# Altium project GBA.PrjPcb (part 2 of 4)

## Sheet [06] - Audio.SchDoc
size A3; DocumentNumber: 8; SheetNumber: 7; SheetTotal: 9
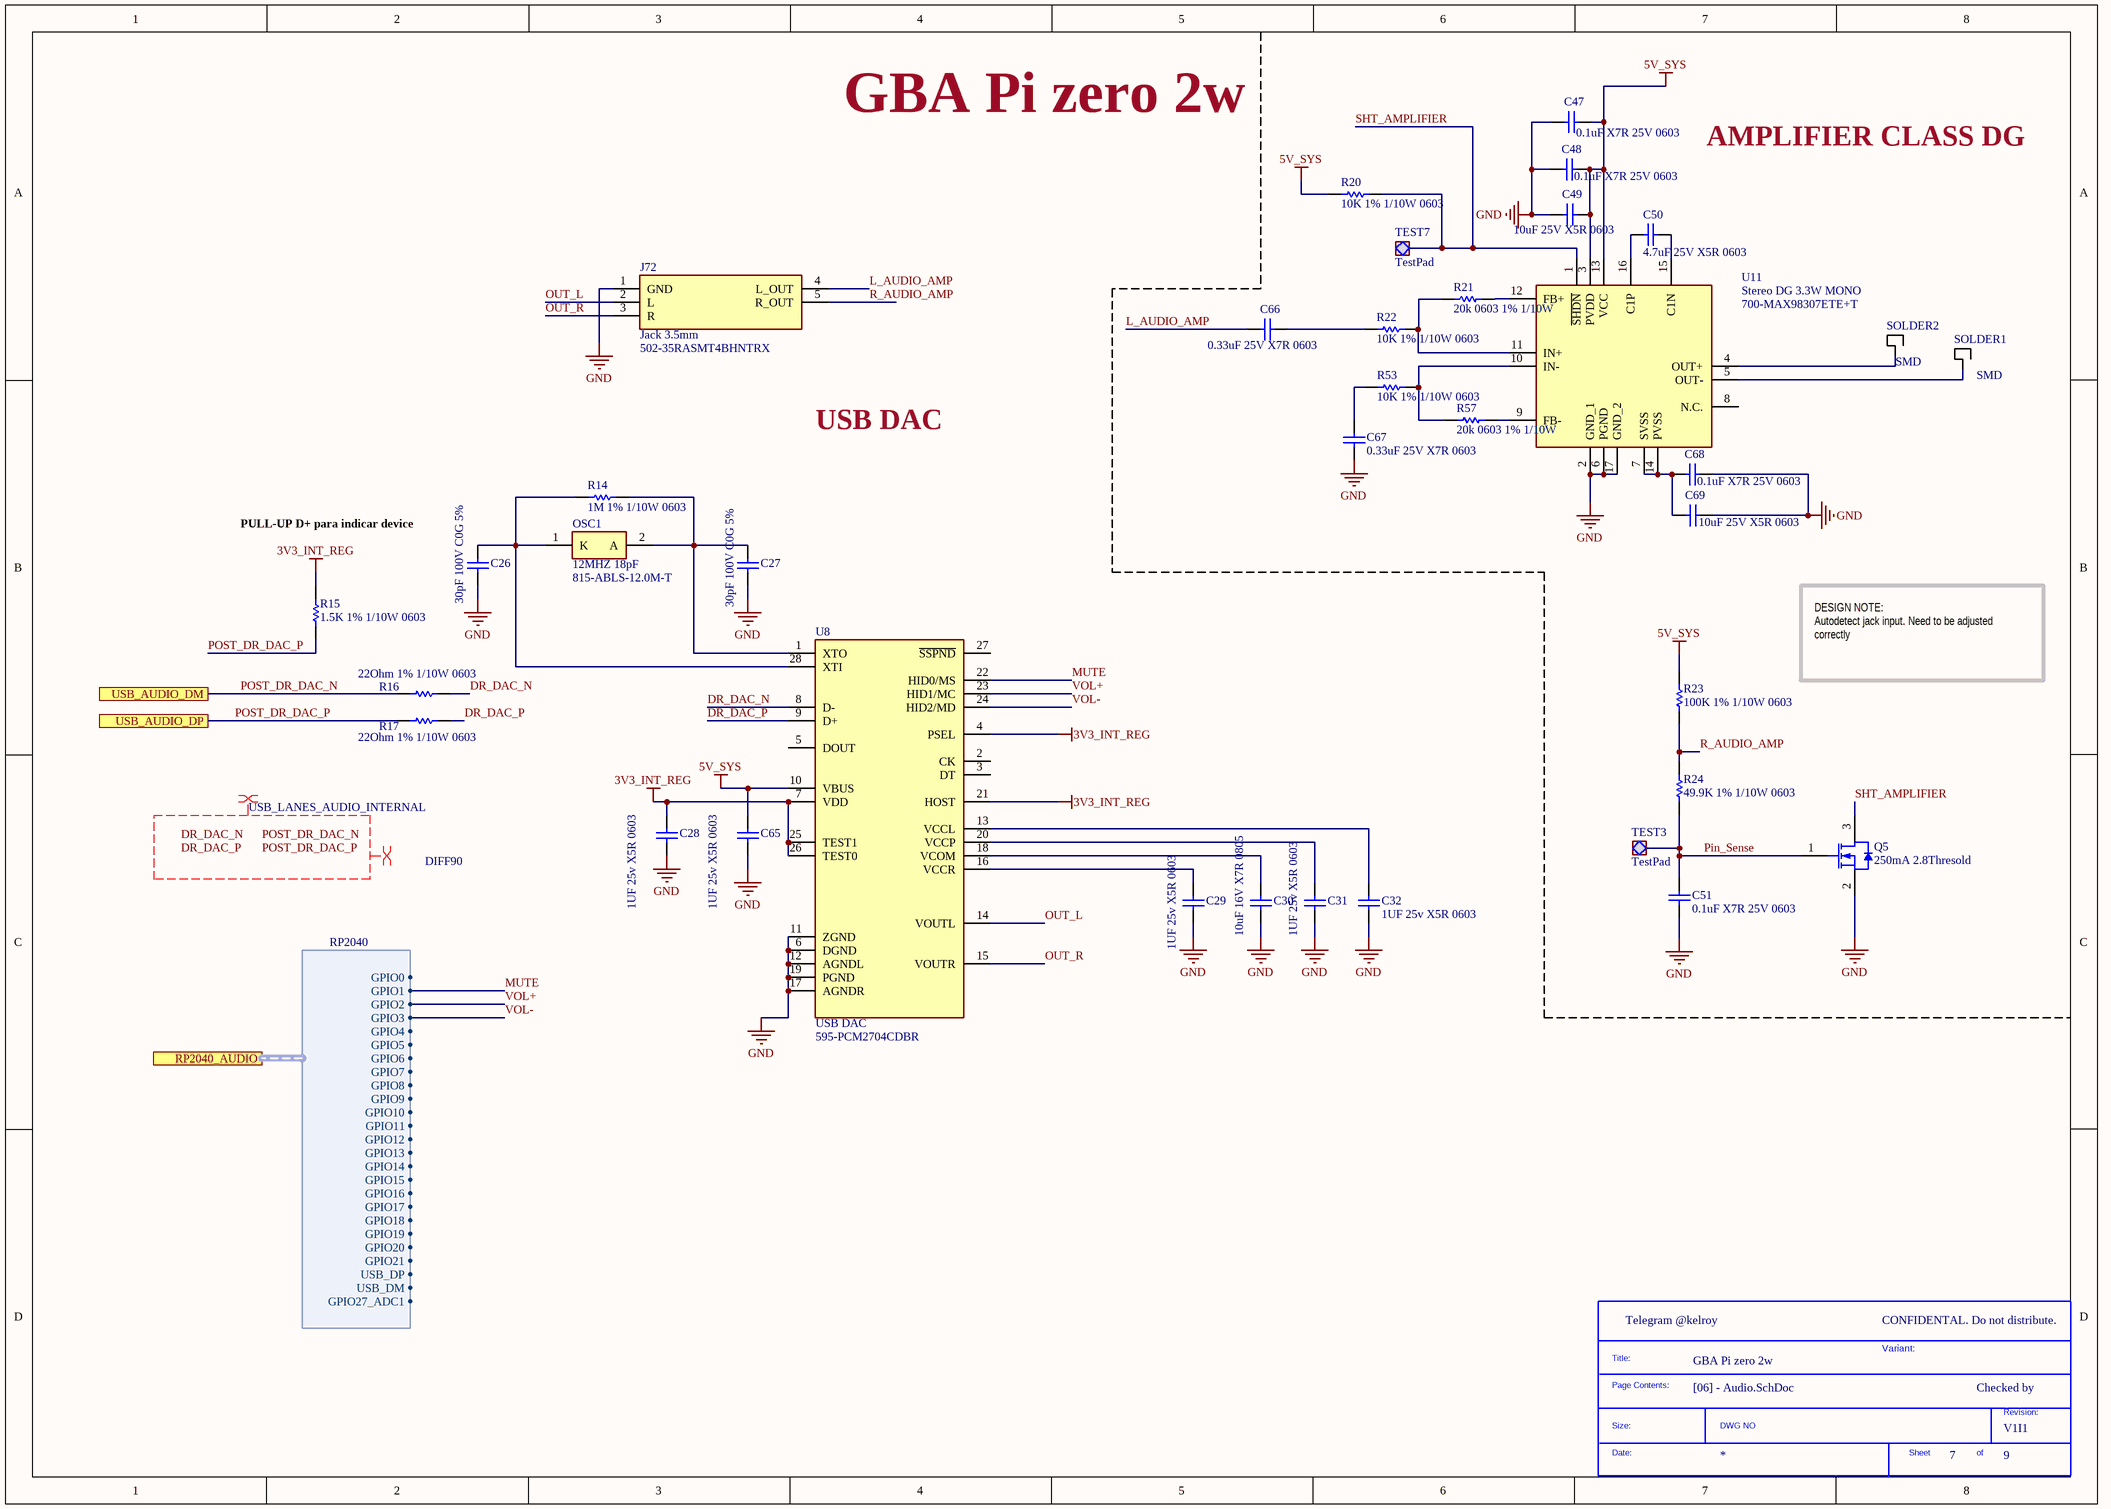
[diagram p6: [06] - Audio.SchDoc]

### Parts
(Parts that share a designator on the sheet are numbered #1, #2 ... from top to bottom, then left to right.)
*#7  SDTitleBlock  (value not drawn)  (graphical)
C26  30pF 100V C0G 5%  [C 0603/1608]
C27  30pF 100V C0G 5%  [C 0603/1608]
C28  1UF 25v X5R 0603  [C 0603/1608]
C29  1UF 25v X5R 0603  [C 0603/1608]
C30  10uF 16V X7R 0805  [C 0805/2012]
C31  1UF 25v X5R 0603  [C 0603/1608]
C32  1UF 25v X5R 0603  [C 0603/1608]
C47  0.1uF X7R 25V 0603  [C 0603/1608]
C48  0.1uF X7R 25V 0603  [C 0603/1608]
C49  10uF 25V X5R 0603  [C 0603/1608]
C50  4.7uF 25V X5R 0603  [C 0603/1608]
C51  0.1uF X7R 25V 0603  [C 0603/1608]
C65  1UF 25v X5R 0603  [C 0603/1608]
C66  0.33uF 25V X7R 0603  [C 0603/1608]
C67  0.33uF 25V X7R 0603  [C 0603/1608]
C68  0.1uF X7R 25V 0603  [C 0603/1608]
C69  10uF 25V X5R 0603  [C 0603/1608]
J72  Jack 3.5mm  Supplier Part Number 1: 502-35RASMT4BHNTRX  [35RASMT4BHNTRX]
OSC1  12MHZ 18pF  Supplier Part Number 1: 815-ABLS-12.0M-T  [HC/49US-(AT49)_1]
Q5  250mA 2.8Thresold  [SOT-23-3]
R14  1M 1% 1/10W 0603  [R 0603/1608]
R15  1.5K 1% 1/10W 0603  [R 0603/1608]
R16  22Ohm 1% 1/10W 0603  [R 0603/1608]
R17  22Ohm 1% 1/10W 0603  [R 0603/1608]
R20  10K 1% 1/10W 0603  [R 0603/1608]
R21  20k 0603 1% 1/10W  [R 0603/1608]
R22  10K 1% 1/10W 0603  [R 0603/1608]
R23  100K 1% 1/10W 0603  [R 0603/1608]
R24  49.9K 1% 1/10W 0603  [R 0603/1608]
R53  10K 1% 1/10W 0603  [R 0603/1608]
R57  20k 0603 1% 1/10W  [R 0603/1608]
SOLDER1  SMD  [SolderPAD]  (no BOM)
SOLDER2  SMD  [SolderPAD]  (no BOM)
TEST3  TestPad  [TestPad]  (no BOM)
TEST7  TestPad  [TestPad]  (no BOM)
U8  USB DAC  Supplier Part Number 1: 595-PCM2704CDBR  [SOP65P780X200-28N]
U11  Stereo DG 3.3W MONO  Supplier Part Number 1: 700-MAX98307ETE+T  [QFN50P300X300X80-17N]

### Ports
RP2040_AUDIO (harness RP2040), USB_AUDIO_DM, USB_AUDIO_DP

### Harnesses
RP2040: GPIO0, GPIO1, GPIO2, GPIO3, USB_DP, USB_DM, GPIO27_ADC1, GPIO4, GPIO5, GPIO6, GPIO7, GPIO8, GPIO9, GPIO10, GPIO11, GPIO12, GPIO13, GPIO14, GPIO15, GPIO16, GPIO17, GPIO18, GPIO19, GPIO20, GPIO21

### Nets
3V3_INT_REG: C28.1 R15.1 U8.4(PSEL) U8.7(VDD) U8.21(HOST) U8.25(TEST1) U8.26(TEST0)
5V_SYS: C47.2 C48.2 C49.2 C65.1 R20.2 R23.2 U8.10(VBUS) U11.3(PVDD) U11.13(VCC)
GND: C26.2 C27.2 C28.2 C29.1 C30.2 C31.1 C32.1 C47.1 C48.1 C49.1 C51.2 C65.2 C67.2 C68.2 C69.2 J72.1(GND) Q5.2(S) U8.6(DGND) U8.11(ZGND) U8.12(AGNDL) U8.17(AGNDR) U8.19(PGND) U11.2(GND_1) U11.6(PGND) U11.17(GND_2)  [project net CSN]
DR_DAC_N: R16.2 U8.8(D-)
DR_DAC_P: R17.2 U8.9(D+)
L_AUDIO_AMP: C66.2 J72.4(L_OUT)
MUTE: U8.22(HID0/MS) ; port RP2040_AUDIO.GPIO1
OUT_L: J72.2(L) U8.14(VOUTL)
OUT_R: J72.3(R) U8.15(VOUTR)
Pin_Sense: C51.1 Q5.1(G) R24.1 TEST3.1
POST_DR_DAC_N: R16.1 ; port USB_AUDIO_DM
POST_DR_DAC_P: R15.2 R17.1 ; port USB_AUDIO_DP
R_AUDIO_AMP: J72.5(R_OUT) R23.1 R24.2
SHT_AMPLIFIER: Q5.3(D) R20.1 TEST7.1 U11.1(~{SHDN})
VOL+: U8.23(HID1/MC) ; port RP2040_AUDIO.GPIO2  [project net RPI_GPIO24]
VOL-: U8.24(HID2/MD) ; port RP2040_AUDIO.GPIO3  [project net RPI_GPIO25]
NetC26_1: C26.1 OSC1.1(K) R14.1 U8.28(XTI)
NetC27_1: C27.1 OSC1.2(A) R14.2 U8.1(XTO)
NetC29_2: C29.2 U8.16(VCCR)
NetC30_1: C30.1 U8.18(VCOM)
NetC31_2: C31.2 U8.20(VCCP)
NetC32_2: C32.2 U8.13(VCCL)
NetC50_1: C50.1 U11.16(C1P)
NetC50_2: C50.2 U11.15(C1N)
NetC66_1: C66.1 R22.2
NetC67_1: C67.1 R53.2
NetC68_1: C68.1 C69.1 U11.7(SVSS) U11.14(PVSS)
NetR21_1: R21.1 R22.1 U11.11(IN+)
NetR21_2: R21.2 U11.12(FB+)
NetR53_1: R53.1 R57.1 U11.10(IN-)
NetR57_2: R57.2 U11.9(FB-)
NetSOLDER1_1: SOLDER1.1 U11.5(OUT-)
NetSOLDER2_1: SOLDER2.1 U11.4(OUT+)

Not connected (* = marked no-connect by the designer): U8 2(CK) 3(DT) 5(DOUT) 27(~{SSPND}); U11 8(N.C.)

### Layout directives
net class USB_LANES_AUDIO_INTERNAL; rule Differential Pairs Routing [Pref Gap = 0.18mm    Min Gap  = 0.18mm    Max Gap  = 0.18mmPref Width = 0.15mm    Min Width  = 0.15mm    Max Width  = 0.15mm]: DR_DAC_N, DR_DAC_P, POST_DR_DAC_N, POST_DR_DAC_P
differential pair; net class DIFF90: DR_DAC_N, DR_DAC_P, POST_DR_DAC_N, POST_DR_DAC_P

### Notes on the sheet
- AMPLIFIER CLASS DG
- USB DAC
- PULL-UP D+ para indicar device
- DESIGN NOTE:
  Autodetect jack input. Need to be adjusted correctly
- CONFIDENTAL. Do not distribute.
- Variant:
- Checked by
- Labels drawn without touching a wire or pin: DR_DAC_N, DR_DAC_P, POST_DR_DAC_N, POST_DR_DAC_P
- (in symbol SDTitleBlock) Title:; Page Contents:; Revision:; Size:; DWG NO; Date:; Sheet; of

### Library data of the parts
C26 C27 = GCM1885C2A300JA16D: Condensadores de cerámica multicapa (MLCC- SMD/SMT) 30pF 100Volts C0G 5%; Manufacturer: Murata; Supplier 1: Mouser; Manufacturer Part Number: GCM1885C2A300JA16D; Stock 1: 7933; Pricing 1: 1=0.15, 10=0.115, 50=0.115, 100=0.054, 1000=0.031, 10000=0.022 (USD); Mount: Surface Mount; Case/Package: 0603; Case Code (Imperial): 0603; Case Code (Metric): 1608; Min Operating Temperature: -25°C; Max Operating Temperature: 125°C; Voltage Rating: 100V; Capacitance: 30pF; Voltage Rating (DC): 100V; Tolerance: 5%; Packaging: Tape and Reel; Package Quantity: 4000; Dielectric: C0G; Termination: SMD/SMT; Length: 1.6mm; Height: 0.8mm; Width: 0.8mm; Thickness: 0.035inch; Depth: 0.8mm; Ratings: AEC-Q200; Radiation Hardening: No; ComponentLink1URL: http://search.murata.co.jp/Ceramy/image/img/w_hinm/S0717E.pdf?src-supplier=Digi-Key; ComponentLink1Description: http://search.murata.co.jp/Ceramy/image/img/w_hinm/S0717E.pdf?src-supplier=Digi-Key; ComponentLink2URL: http://www.murata.com/products/catalog/pdf/c03e.pdf?src-supplier=Avnet; ComponentLink2Description: http://www.murata.com/products/catalog/pdf/c03e.pdf?src-supplier=Avnet; Supplier Part Number 1: 81-GCM1885C2A300JA6D
C28 C29 C31 C32 C65 = CC0603KRX5R8BB105: CAP CER 1UF 25V X5R 0603; Manufacturer: Yageo; Tolerance: 10%; Supplier 1: Mouser; Manufacturer Part Number: CC0603KRX5R8BB105; RoHS: Yes; Stock 1: 9567246; Pricing 1: 1 = 0,10000, 10 = 0,04700, 50 = 0,04700, 100 = 0,01700, 1000 = 0,01600, 10000 = 0,00800 (USD); Mount: Surface Mount; Case/Package: 0603; Number of Pins: 2; Case Code (Metric): 1608; Case Code (Imperial): 0603; Min Operating Temperature: -55°C; Max Operating Temperature: 85°C; Package Quantity: 1; Capacitance: 1uF; Voltage Rating: 25V; Packaging: Tape and Reel; Dielectric: X5R; Termination: SMD/SMT; Voltage Rating (DC): 25V; Length: 1.6mm; Height: 0.8mm; Width: 0.031inch; Thickness: 0.035inch; Depth: 0.8mm; Radiation Hardening: No; REACH SVHC: No SVHC; Lead Free: Lead Free; Halogen Free: Halogen Free; ComponentLink1URL: https://datasheet.ciiva.com/176/mlccorderingcode-176785.pdf?src-supplier=Digi-Key; ComponentLink1Description: https://datasheet.ciiva.com/176/mlccorderingcode-176785.pdf?src-supplier=Digi-Key; ComponentLink2URL: https://datasheet.ciiva.com/176/mlccorderingcode-176786.pdf?src-supplier=Digi-Key; ComponentLink2Description: https://datasheet.ciiva.com/176/mlccorderingcode-176786.pdf?src-supplier=Digi-Key; ComponentLink3URL: https://datasheet.ciiva.com/176/mlccorderingcode-176787.pdf?src-supplier=Digi-Key; ComponentLink3Description: https://datasheet.ciiva.com/176/mlccorderingcode-176787.pdf?src-supplier=Digi-Key; ComponentLink4URL: https://datasheet.ciiva.com/17436/upy-gphc-x5r-4v-to-50v-12-17436952.pdf?src-supplier=Avnet+Europe; ComponentLink4Description: https://datasheet.ciiva.com/17436/upy-gphc-x5r-4v-to-50v-12-17436952.pdf?src-supplier=Avnet+Europe; ComponentLink5URL: https://datasheet.ciiva.com/7978/1525783-7978171.pdf?src-supplier=Element14; ComponentLink5Description: https://datasheet.ciiva.com/7978/1525783-7978171.pdf?src-supplier=Element14; ComponentLink6URL: https://datasheet.ciiva.com/11586/upy-gphc-x5r-4v-to-50v-12-11586318.pdf?src-supplier=Avnet; ComponentLink6Description: https://datasheet.ciiva.com/11586/upy-gphc-x5r-4v-to-50v-12-11586318.pdf?src-supplier=Avnet; Supplier Part Number 1: 603-CC603KRX5R8BB105
C30 = CL21B106KOQNNNE: CAP CER 10UF 16V X7R 0805; Manufacturer: Samsung Electro-Mechanics; Tolerance: ±10%; Notification: Current market demand for these product types have resulted in fluctuating and extending lead times. Lead times may differ.; Supplier 1: Digi-Key; Manufacturer Part Number: CL21B106KOQNNNE; RoHS: RoHS Compliant; Category: Capacitors; Stock 1: 20000; Pricing 1: 1=0.24, 10=0.163, 100=0.0923, 500=0.06514, 1000=0.057 (GBP); Packaging: Cut Tape (CT); Part Status: Active; Voltage - Rated: 16V; Temperature Coefficient: X7R; Operating Temperature: -55°C ~ 125°C; Features: -; Ratings: -; Applications: General Purpose; Mounting Type: Surface Mount, MLCC; Package / Case: 0805 (2012 Metric); Size / Dimension: 0.079" L x 0.049" W (2.00mm x 1.25mm); Height - Seated (Max): -; Thickness (Max): 0.055" (1.40mm); Lead Spacing: -; Lead Style: -; ComponentLink1URL: http://www.samsungsem.com/kr/support/product-search/mlcc/CL21B106KOQNNNE.jsp; ComponentLink1Description: http://www.samsungsem.com/kr/support/product-search/mlcc/CL21B106KOQNNNE.jsp; Supplier Part Number 1: 1276-2872-1-ND
C47 C48 C51 C68 = 885012206071: WURTH ELEKTRONIK         885012206071             SMD Multilayer Ceramic Capacitor, 0603 [1608 Metric], 0.1 F, 25 V,  10%, X7R, WCAP-CSGP Series; Manufacturer: Wurth Electronics; Capacitance: 100nF; Supplier 1: Mouser; Manufacturer Part Number: 885012206071; Stock 1: 202580; Pricing 1: 1=0.1, 10=0.046, 50=0.046, 100=0.041, 1000=0.036, 10000=0.036 (USD); Mount: Surface Mount; Case/Package: 0603; Case Code (Metric): 1608; Case Code (Imperial): 0603; Min Operating Temperature: -55°C; Max Operating Temperature: 125°C; Packaging: Cut Tape; Voltage Rating: 25V; Dielectric: X7R; Tolerance: 10%; Voltage Rating (DC): 25V; Length: 0.063inch; Width: 0.031inch; Thickness: 0.037inch; REACH SVHC: Unknown; Supplier Part Number 1: 710-885012206071
C49 C69 = GRM188R61E106KA73D: Cap Ceramic 10uF 25V X5R 10% SMD 0603 85°C Paper T/R; Manufacturer 1: Murata; Supplier 1: Mouser; Manufacturer Part Number 1: GRM188R61E106KA73D; Stock 1: 265910; Pricing 1: 1=0.37000, 10=0.25900, 50=0.25900, 100=0.15500, 500=0.11600, 1000=0.09800, 4000=0.07600, 8000=0.07000, 10000=0.07000, 12000=0.06300 (USD); RoHS: No; Case/Package: 0603; Supplier Part Number 1: 81-GRM188R61E106KA3D
C50 = TMK107BBJ475MA-T: Condensadores de cerámica multicapa (MLCC- SMD/SMT) 0603 25VDC 4.7uF 20% X5R; Manufacturer 1: Taiyo Yuden; Supplier 1: Mouser; Manufacturer Part Number 1: TMK107BBJ475MA-T; Stock 1: 7442; Pricing 1: 1=0.31000, 10=0.15200, 50=0.15200, 100=0.10900, 1000=0.08300, 10000=0.06500 (USD); RoHS: No; Supplier Part Number 1: 963-TMK107BBJ475MA-T
C66 C67 = 885012206074: CAP CER 0.33UF 25V X7R 0603; Manufacturer 1: Wurth Electronics; Capacitance: 330nF; Tolerance: 10%; Supplier 1: Mouser; Manufacturer Part Number 1: 885012206074; RoHS: Yes; Category: Ceramic Capacitors; Stock 1: 4921; Pricing 1: 1=0,10000, 10=0,08100, 25=0,08100, 50=0,08100, 100=0,07300, 250=0,07300 (USD); Mount: Surface Mount; Case/Package: 0603; Case Code (Metric): 1608; Case Code (Imperial): 0603; Min Operating Temperature: -55°C; Max Operating Temperature: 125°C; Packaging: Tape and Reel; Voltage Rating: 25V; Length: 0.063inch; Width: 0.031inch; Thickness: 0.037inch; ComponentLink1URL: http://www.farnell.com/datasheets/2031845.pdf?src-supplier=Farnell; ComponentLink1Description: http://www.farnell.com/datasheets/2031845.pdf?src-supplier=Farnell; ComponentLink2URL: https://katalog.we-online.de/pbs/datasheet/885012206074.pdf?src-supplier=Digi-Key; ComponentLink2Description: https://katalog.we-online.de/pbs/datasheet/885012206074.pdf?src-supplier=Digi-Key; ComponentLink3URL: http://www.farnell.com/datasheets/2031845.pdf?src-supplier=Newark; ComponentLink3Description: http://www.farnell.com/datasheets/2031845.pdf?src-supplier=Newark; Supplier Part Number 1: 710-885012206074
J72 = 35RASMT4BHNTRX: SWC 35RASMT4BHNTRX Connectors > Audio - Video > Jacks (Audio) > 1/4 Audio Jacks; Manufacturer: Switchcraft; Supplier 1: Mouser; Manufacturer Part Number: 35RASMT4BHNTRX; RoHS: Yes; Category: Circular Connectors; Stock 1: 5330; Pricing 1: 1=1,60000, 10=1,31000, 50=1,31000, 100=1,25000, 250=1,13000, 500=1,04000, 1000=0,95900, 10000=0,95900 (USD); ComponentLink1URL: https://datasheet.ciiva.com/390/35rasmt4bhntrx-cd-390487.pdf?src-supplier=Digi-Key; ComponentLink1Description: https://datasheet.ciiva.com/390/35rasmt4bhntrx-cd-390487.pdf?src-supplier=Digi-Key; ComponentLink2URL: https://datasheet.ciiva.com/11720/0900766b80e28029-11720622.pdf?src-supplier=RSComponents; ComponentLink2Description: https://datasheet.ciiva.com/11720/0900766b80e28029-11720622.pdf?src-supplier=RSComponents; ComponentLink3URL: https://datasheet.ciiva.com/390/35rasmt4bhntrx-cd-390488.pdf?src-supplier=Digi-Key; ComponentLink3Description: https://datasheet.ciiva.com/390/35rasmt4bhntrx-cd-390488.pdf?src-supplier=Digi-Key; ComponentLink4URL: https://datasheet.ciiva.com/390/35rasmt4bhntrx-cd-390489.pdf?src-supplier=Digi-Key; ComponentLink4Description: https://datasheet.ciiva.com/390/35rasmt4bhntrx-cd-390489.pdf?src-supplier=Digi-Key
OSC1 = ABLS-12.000MHZ-B4-T: CRYSTAL 12.0000MHZ 18PF SMD; Manufacturer: Abracon; Frequency Tolerance: 30ppm; ESR (Equivalent Series Resistance): 50R; Frequency Stability: 50ppm; Supplier 1: Mouser; Manufacturer Part Number: ABLS-12.000MHZ-B4-T; RoHS: Yes; Stock 1: 9442; Pricing 1: 1 = 0,27000, 10 = 0,22500, 50 = 0,20400, 100 = 0,20400, 1000 = 0,16300, 10000 = 0,14500 (USD); Mount: Surface Mount; Case/Package: SMD/SMT; Min Operating Temperature: -20°C; Max Operating Temperature: 70°C; Package Quantity: 1000; Frequency: 12MHz; Load Capacitance: 18pF; Packaging: Tape and Reel; Tolerance: 30ppm; Termination: SMD/SMT; Series Resistance: 50R; Length: 11.4mm; Height: 0.165inch; Width: 0.185inch; Depth: 4.7mm; Radiation Hardening: No; REACH SVHC: Yes; Lead Free: Lead Free; ComponentLink1URL: https://datasheet.ciiva.com/15116/getdatasheetpartid-719931-15116807.pdf?src-supplier=Verical; ComponentLink1Description: https://datasheet.ciiva.com/15116/getdatasheetpartid-719931-15116807.pdf?src-supplier=Verical; ComponentLink2URL: https://datasheet.ciiva.com/854/abls-854132.pdf?src-supplier=Digi-Key; ComponentLink2Description: https://datasheet.ciiva.com/854/abls-854132.pdf?src-supplier=Digi-Key; ComponentLink3URL: https://datasheet.ciiva.com/854/abls-854133.pdf?src-supplier=Digi-Key; ComponentLink3Description: https://datasheet.ciiva.com/854/abls-854133.pdf?src-supplier=Digi-Key; ComponentLink4URL: https://datasheet.ciiva.com/854/abls-854134.pdf?src-supplier=Digi-Key; ComponentLink4Description: https://datasheet.ciiva.com/854/abls-854134.pdf?src-supplier=Digi-Key; ComponentLink5URL: https://datasheet.ciiva.com/16339/abls-16339801.pdf?src-supplier=Future+Electronics; ComponentLink5Description: https://datasheet.ciiva.com/16339/abls-16339801.pdf?src-supplier=Future+Electronics; ComponentLink6URL: https://datasheet.ciiva.com/3174/abls-3174254.pdf?src-supplier=Avnet; ComponentLink6Description: https://datasheet.ciiva.com/3174/abls-3174254.pdf?src-supplier=Avnet; ComponentLink7URL: https://datasheet.ciiva.com/4944/abls-44621-4944814.pdf?src-supplier=Mouser; ComponentLink7Description: https://datasheet.ciiva.com/4944/abls-44621-4944814.pdf?src-supplier=Mouser
Q5 = RK7002BMT116: MOSFET N-CH 60V 0.25A SST3; Manufacturer: Rohm; Rds On Max: 2.4R; Input Capacitance: 15pF; Max Power Dissipation: 200mW; Number of Channels: 1; Drain to Source Resistance: 1.7R; Gate to Source Voltage (Vgs): 20V; Fall Time: 28ns; Rise Time: 5ns; Turn-Off Delay Time: 18ns; Turn-On Delay Time: 3.5ns; FET Type: 1 N-Channel; Supplier 1: Mouser; Manufacturer Part Number: RK7002BMT116; Stock 1: 237072; Pricing 1: 1=0.15, 10=0.133, 50=0.133, 100=0.047, 1000=0.031, 10000=0.021 (USD); Mount: Surface Mount; Case/Package: TO-236-3; Max Operating Temperature: 150°C; Package Quantity: 3000; Packaging: Tape and Reel; Drain to Source Voltage (Vdss): 60V; Continuous Drain Current (ID): 250mA; Drain to Source Breakdown Voltage: 60V; Lead Free: Lead Free; Supplier Part Number 1: 755-RK7002BMT116
R14 = RC0603FR-071ML: RES SMD 1M OHM 1% 1/10W 0603; Manufacturer 1: Yageo; Voltage Rating: 50V; Resistance: 1MR; Power Rating: 100mW; Temperature Coefficient: 100ppm/°C; Supplier 1: Digi-Key; Manufacturer Part Number 1: RC0603FR-071ML; Stock 1: 9751331; Pricing 1: 1=0,10000, 10=0,02400, 100=0,00970, 1000=0,00437, 2500=0,00379 (USD); RoHS: Yes; Case/Package: 0603; Number of Pins: 2; Case Code (Imperial): 0603; Case Code (Metric): 1608; Min Operating Temperature: -55°C; Max Operating Temperature: 155°C; Voltage Rating (DC): 50V; Tolerance: 1%; Packaging: Tape and Reel; Package Quantity: 5000; Termination: SMD/SMT; Composition: Thick Film; Military Standard: Not; Length: 1.6mm; Height: 0.45mm; Width: 0.8mm; Depth: 0.8mm; REACH SVHC: No SVHC; Lead Free: Lead Free; ComponentLink1URL: https://datasheet.ciiva.com/11819/0900766b80f96399-11819295.pdf?src-supplier=RSComponents; ComponentLink1Description: https://datasheet.ciiva.com/11819/0900766b80f96399-11819295.pdf?src-supplier=RSComponents; ComponentLink2URL: https://datasheet.ciiva.com/7983/443971-7983614.pdf?src-supplier=Element14; ComponentLink2Description: https://datasheet.ciiva.com/7983/443971-7983614.pdf?src-supplier=Element14; ComponentLink3URL: https://datasheet.ciiva.com/12555/rc0603-272842-12555388.pdf?src-supplier=Mouser; ComponentLink3Description: https://datasheet.ciiva.com/12555/rc0603-272842-12555388.pdf?src-supplier=Mouser; Supplier Part Number 1: 311-1.00MHRDKR-ND
R15 = RC0603FR-071K5L: RES SMD 1.5K OHM 1% 1/10W 0603; Manufacturer: Yageo; Resistance: 1.5kR; Temperature Coefficient: 100ppm/°C; Voltage Rating (DC): 50V; Power Rating: 100mW; Supplier 1: Mouser; Manufacturer Part Number: RC0603FR-071K5L; RoHS: Yes; Stock 1: 1280962; Pricing 1: 1 = 0,10000, 10 = 0,01800, 50 = 0,01800, 100 = 0,00600, 1000 = 0,00500, 10000 = 0,00300 (USD); Case/Package: 0603; Number of Pins: 2; Case Code (Metric): 1608; Case Code (Imperial): 0603; Min Operating Temperature: -55°C; Max Operating Temperature: 155°C; Tolerance: 1%; Packaging: Tape and Reel; Composition: Thick Film; Voltage Rating: 50V; Package Quantity: 1; Number of Terminations: 2; Termination: SMD/SMT; Military Standard: Not; Max Power Dissipation: 100mW; Features: Moisture Resistant; Length: 0.063inch; Height: 0.022inch; Width: 0.031inch; Depth: 0.8mm; REACH SVHC: No SVHC; Lead Free: Lead Free; ComponentLink1URL: https://datasheet.ciiva.com/2454/pyu-r-int-thick-7-2454513.pdf?src-supplier=Digi-Key; ComponentLink1Description: https://datasheet.ciiva.com/2454/pyu-r-int-thick-7-2454513.pdf?src-supplier=Digi-Key; ComponentLink2URL: https://datasheet.ciiva.com/2454/pyu-r-int-thick-7-2454514.pdf?src-supplier=Digi-Key; ComponentLink2Description: https://datasheet.ciiva.com/2454/pyu-r-int-thick-7-2454514.pdf?src-supplier=Digi-Key; ComponentLink3URL: https://datasheet.ciiva.com/2454/pyu-r-int-thick-7-2454515.pdf?src-supplier=Digi-Key; ComponentLink3Description: https://datasheet.ciiva.com/2454/pyu-r-int-thick-7-2454515.pdf?src-supplier=Digi-Key; ComponentLink4URL: https://datasheet.ciiva.com/46440/1868787-46440895.pdf?src-supplier=Element14; ComponentLink4Description: https://datasheet.ciiva.com/46440/1868787-46440895.pdf?src-supplier=Element14; Supplier Part Number 1: 603-RC0603FR-071K5L
R16 R17 = RC0603FR-0722RL: RES SMD 22 OHM 1% 1/10W 0603; Manufacturer: Yageo; Resistance: 22R; Temperature Coefficient: 100ppm/°C; Voltage Rating (DC): 50V; Power Rating: 100mW; Supplier 1: Mouser; Manufacturer Part Number: RC0603FR-0722RL; RoHS: Yes; Stock 1: 1162810; Pricing 1: 1 = 0,10000, 10 = 0,01800, 50 = 0,01800, 100 = 0,00600, 1000 = 0,00500, 10000 = 0,00300 (USD); Case/Package: 0603; Number of Pins: 2; Case Code (Metric): 1608; Case Code (Imperial): 0603; Min Operating Temperature: -55°C; Max Operating Temperature: 155°C; Tolerance: 1%; Composition: Thick Film; Packaging: Tape and Reel; Voltage Rating: 50V; Package Quantity: 1; Number of Terminations: 2; Termination: SMD/SMT; Military Standard: Not; Max Power Dissipation: 100mW; Features: Moisture Resistant; Length: 1.6mm; Height: 0.022inch; Width: 0.031inch; Depth: 0.8mm; REACH SVHC: No SVHC; Lead Free: Lead Free; ComponentLink1URL: https://datasheet.ciiva.com/11819/0900766b80f96399-11819285.pdf?src-supplier=RSComponents; ComponentLink1Description: https://datasheet.ciiva.com/11819/0900766b80f96399-11819285.pdf?src-supplier=RSComponents; ComponentLink2URL: https://datasheet.ciiva.com/2454/pyu-r-int-thick-7-2454354.pdf?src-supplier=Digi-Key; ComponentLink2Description: https://datasheet.ciiva.com/2454/pyu-r-int-thick-7-2454354.pdf?src-supplier=Digi-Key; ComponentLink3URL: https://datasheet.ciiva.com/2454/pyu-r-int-thick-7-2454355.pdf?src-supplier=Digi-Key; ComponentLink3Description: https://datasheet.ciiva.com/2454/pyu-r-int-thick-7-2454355.pdf?src-supplier=Digi-Key; ComponentLink4URL: https://datasheet.ciiva.com/2454/pyu-r-int-thick-7-2454356.pdf?src-supplier=Digi-Key; ComponentLink4Description: https://datasheet.ciiva.com/2454/pyu-r-int-thick-7-2454356.pdf?src-supplier=Digi-Key; ComponentLink5URL: https://datasheet.ciiva.com/46440/1868787-46440901.pdf?src-supplier=Element14; ComponentLink5Description: https://datasheet.ciiva.com/46440/1868787-46440901.pdf?src-supplier=Element14; ComponentLink6URL: https://datasheet.ciiva.com/46395/443971-46395032.pdf?src-supplier=Element14; ComponentLink6Description: https://datasheet.ciiva.com/46395/443971-46395032.pdf?src-supplier=Element14; Supplier Part Number 1: 603-RC0603FR-0722RL
R20 R22 R53 = RC0603FR-0710KL: RES SMD 10K OHM 1% 1/10W 0603; Manufacturer: Yageo; Power (Watts): 0.1W, 1/10W; Temperature Coefficient: ±100ppm/°C; Supplier 1: Digi-Key; Manufacturer Part Number: RC0603FR-0710KL; RoHS: RoHS Compliant; Category: Resistors; Stock 1: 47851285; Pricing 1: 1=0.08, 10=0.013, 100=0.005, 1000=0.00224, 2500=0.00195 (EUR); Packaging: Cut Tape (CT); Part Status: Active; Tolerance: ±1%; Composition: Thick Film; Features: Moisture Resistant; Operating Temperature: -55°C ~ 155°C; Package / Case: 0603 (1608 Metric); Supplier Device Package: 0603; Size / Dimension: 0.063" L x 0.032" W (1.60mm x 0.80mm); Height - Seated (Max): 0.022" (0.55mm); Failure Rate: -; ComponentLink1URL: http://www.yageo.com/documents/recent/PYu-RC_Group_51_RoHS_L_8.pdf; ComponentLink1Description: http://www.yageo.com/documents/recent/PYu-RC_Group_51_RoHS_L_8.pdf; Supplier Part Number 1: 311-10.0KHRCT-ND
R21 R57 = RC0603FR-0720KL: RES SMD 20K OHM 1% 1/10W 0603; Manufacturer 1: Yageo; Resistance: 20kR; Temperature Coefficient: 100ppm/°C; Voltage Rating (DC): 50V; Power Rating: 100mW; Supplier 1: Mouser; Manufacturer Part Number 1: RC0603FR-0720KL; RoHS: Yes; Category: Chip SMD Resistors; Stock 1: 754329; Pricing 1: 1=0,10000, 10=0,01800, 100=0,00600, 1000=0,00500, 5000=0,00300, 10000=0,00300 (USD); Case/Package: 0603; Number of Pins: 2; Case Code (Imperial): 0603; Case Code (Metric): 1608; Min Operating Temperature: -55°C; Max Operating Temperature: 155°C; Tolerance: 1%; Composition: Thick Film; Packaging: Tape and Reel; Voltage Rating: 50V; Package Quantity: 1; Termination: SMD/SMT; Number of Terminations: 2; Military Standard: Not; Max Power Dissipation: 100mW; Features: Moisture Resistant; Length: 0.063inch; Height: 0.022inch; Width: 0.031inch; Depth: 0.8mm; Lead Free: Lead Free; REACH SVHC: No SVHC; ComponentLink1URL: https://datasheet.ciiva.com/11808/0900766b80f96399-11808275.pdf?src-supplier=RSComponents; ComponentLink1Description: https://datasheet.ciiva.com/11808/0900766b80f96399-11808275.pdf?src-supplier=RSComponents; ComponentLink2URL: https://datasheet.ciiva.com/22747/443971-22747525.pdf?src-supplier=Element14; ComponentLink2Description: https://datasheet.ciiva.com/22747/443971-22747525.pdf?src-supplier=Element14; ComponentLink3URL: https://datasheet.ciiva.com/2453/pyu-r-int-thick-7-2453910.pdf?src-supplier=Digi-Key; ComponentLink3Description: https://datasheet.ciiva.com/2453/pyu-r-int-thick-7-2453910.pdf?src-supplier=Digi-Key; ComponentLink4URL: https://datasheet.ciiva.com/2453/pyu-r-int-thick-7-2453911.pdf?src-supplier=Digi-Key; ComponentLink4Description: https://datasheet.ciiva.com/2453/pyu-r-int-thick-7-2453911.pdf?src-supplier=Digi-Key; ComponentLink5URL: https://datasheet.ciiva.com/2453/pyu-r-int-thick-7-2453912.pdf?src-supplier=Digi-Key; ComponentLink5Description: https://datasheet.ciiva.com/2453/pyu-r-int-thick-7-2453912.pdf?src-supplier=Digi-Key; Supplier Part Number 1: 603-RC0603FR-0720KL
R23 = RC0603FR-07100KL: RES SMD 100K OHM 1% 1/10W 0603; Manufacturer: Yageo; Power (Watts): 0.1W, 1/10W; Temperature Coefficient: ±100ppm/°C; Supplier 1: Digi-Key; Manufacturer Part Number: RC0603FR-07100KL; RoHS: RoHS Compliant; Category: Resistors; Stock 1: 6298016; Pricing 1: 1=0.08, 10=0.013, 100=0.005, 1000=0.00224, 2500=0.00195 (EUR); Packaging: Cut Tape (CT); Part Status: Active; Tolerance: ±1%; Composition: Thick Film; Features: Moisture Resistant; Operating Temperature: -55°C ~ 155°C; Package / Case: 0603 (1608 Metric); Supplier Device Package: 0603; Size / Dimension: 0.063" L x 0.032" W (1.60mm x 0.80mm); Height - Seated (Max): 0.022" (0.55mm); Failure Rate: -; ComponentLink1URL: http://www.yageo.com/documents/recent/PYu-RC_Group_51_RoHS_L_8.pdf; ComponentLink1Description: http://www.yageo.com/documents/recent/PYu-RC_Group_51_RoHS_L_8.pdf; Supplier Part Number 1: 311-100KHRCT-ND
R24 = RC0603FR-0749K9L: RES SMD 49.9K OHM 1% 1/10W 0603; Manufacturer: Yageo; Power Rating: 100mW; Resistance: 49.9kR; Temperature Coefficient: 100ppm/°C; Voltage Rating (DC): 50V; Supplier 1: Mouser; Manufacturer Part Number: RC0603FR-0749K9L; Stock 1: 800929; Pricing 1: 1=0.1, 10=0.018, 50=0.018, 100=0.006, 1000=0.005, 10000=0.003 (USD); Mount: Surface Mount; Case/Package: 0603; Case Code (Metric): 1608; Case Code (Imperial): 0603; Min Operating Temperature: -55°C; Max Operating Temperature: 155°C; Tolerance: 1%; Packaging: Tape and Reel; Package Quantity: 1; Voltage Rating: 50V; Composition: Thick Film; Number of Terminations: 2; Termination: SMD/SMT; Military Standard: Not; Max Power Dissipation: 100mW; Features: Moisture Resistant; Length: 0.063inch; Height: 0.022inch; Width: 0.031inch; Depth: 0.8mm; Lead Free: Lead Free; ComponentLink1URL: http://documents.rs-components.com/techlib://itc_doclist_GB.htm?stockno=5047537; ComponentLink1Description: http://documents.rs-components.com/techlib://itc_doclist_GB.htm?stockno=5047537; ComponentLink2URL: https://www.verical.com/server-webapp/html/getDatasheet?partID=323805; ComponentLink2Description: https://www.verical.com/server-webapp/html/getDatasheet?partID=323805; ComponentLink3URL: http://www.yageo.com/documents/recent/PYu-RC_Group_51_RoHS_L_10.pdf; ComponentLink3Description: http://www.yageo.com/documents/recent/PYu-RC_Group_51_RoHS_L_10.pdf; ComponentLink4URL: http://www.yageo.com/documents/recent/PYu-RC_Group_51_RoHS_L_9.pdf; ComponentLink4Description: http://www.yageo.com/documents/recent/PYu-RC_Group_51_RoHS_L_9.pdf; Supplier Part Number 1: 603-RC0603FR-0749K9L
SOLDER1 SOLDER2 = SOLDERPAD
TEST3 TEST7 = PP_SMT_ROUND_2MM: Probe Pad, SMT, ROUND, 2.0MM
U8 = PCM2704CDBR: PCM2704C 98DB Snr Stereo Full Sp; Manufacturer: Texas Instruments; Number of DAC Channels: 0; Number of Channels: 2; Max Supply Voltage: 5.25V; Min Supply Voltage: 3V; Interface: Serial,SPI,USB; Resolution: 16b; Sampling Rate: 48000S/s; Supply Type: Analog,Digital; Conversion Rate: 48KS/s; Output Type: Voltage; Operating Supply Voltage: 5V; Supplier 1: Mouser; Manufacturer Part Number: PCM2704CDBR; RoHS: Yes; Category: Amplifiers - Audio; Stock 1: 1234; Pricing 1: 1=9,13000, 10=8,25000, 25=7,86000, 50=7,86000, 100=6,83000, 250=6,52000, 500=5,95000, 1000=5,57000, 2000=5,56000, 10000=5,56000 (USD); Mount: Surface Mount; Case/Package: SSOP; Number of Pins: 28; Min Operating Temperature: -25°C; Max Operating Temperature: 85°C; Packaging: Tape and Reel; Package Quantity: 2000; Number of Converters: 2; Signal to Noise Ratio (SNR): 98dB; Number of Analog Inputs: 0; Number of Analog Outputs: 2; Series: PCM2704C; Radiation Hardening: No; Lead Free: Lead Free; RoHS Compliant: Yes; ComponentLink1URL: https://datasheet.ciiva.com/1825/pcm2704c-1825851.pdf?src-supplier=Digi-Key; ComponentLink1Description: https://datasheet.ciiva.com/1825/pcm2704c-1825851.pdf?src-supplier=Digi-Key; ComponentLink2URL: https://datasheet.ciiva.com/1825/pcm2704c-1825852.pdf?src-supplier=Digi-Key; ComponentLink2Description: https://datasheet.ciiva.com/1825/pcm2704c-1825852.pdf?src-supplier=Digi-Key; ComponentLink3URL: https://datasheet.ciiva.com/1825/pcm2704c-1825853.pdf?src-supplier=Digi-Key; ComponentLink3Description: https://datasheet.ciiva.com/1825/pcm2704c-1825853.pdf?src-supplier=Digi-Key
U11 = MAX98307ETE+T: IC AMP AUD 3.3W MONO DG 16TQFN; Manufacturer 1: Maxim; Common Mode Rejection Ratio: 65dB; Nominal Supply Current: 1.85mA; Max Power Dissipation: 1.667W; Min Supply Voltage: 2.6V; Max Supply Voltage: 5.25V; Power Supply Rejection Ratio (PSRR): 78dB; Max Output Current: 800mA; Supplier 1: Mouser; Manufacturer Part Number 1: MAX98307ETE+T; RoHS: Yes; Category: Amplifiers - Audio; Stock 1: 6006; Pricing 1: 1=1,73000, 10=1,55000, 25=1,47000, 50=1,46000, 100=1,17000, 250=1,03000 (USD); Mount: Surface Mount; Number of Pins: 16; Contact Plating: Tin,Matte; Min Operating Temperature: -40°C; Max Operating Temperature: 85°C; Package Quantity: 1; Packaging: Tape and Reel; Output Power: 3.3W; Max Output Power: 3.3W; Radiation Hardening: No; ComponentLink1URL: https://datasheet.ciiva.com/12300/max98307-max98308-111199-12300835.pdf?src-supplier=Mouser; ComponentLink1Description: https://datasheet.ciiva.com/12300/max98307-max98308-111199-12300835.pdf?src-supplier=Mouser; ComponentLink2URL: https://datasheet.ciiva.com/2968/max98307-max98308-2968008.pdf?src-supplier=Avnet; ComponentLink2Description: https://datasheet.ciiva.com/2968/max98307-max98308-2968008.pdf?src-supplier=Avnet; ComponentLink3URL: https://datasheet.ciiva.com/1789/max98307-max98308-1789883.pdf?src-supplier=Digi-Key; ComponentLink3Description: https://datasheet.ciiva.com/1789/max98307-max98308-1789883.pdf?src-supplier=Digi-Key; ComponentLink4URL: https://datasheet.ciiva.com/1789/max98307-max98308-1789884.pdf?src-supplier=Digi-Key; ComponentLink4Description: https://datasheet.ciiva.com/1789/max98307-max98308-1789884.pdf?src-supplier=Digi-Key; ComponentLink5URL: https://datasheet.ciiva.com/1789/max98307-max98308-1789885.pdf?src-supplier=Digi-Key; ComponentLink5Description: https://datasheet.ciiva.com/1789/max98307-max98308-1789885.pdf?src-supplier=Digi-Key